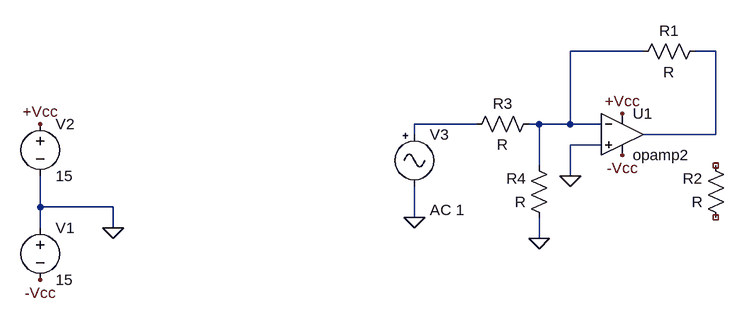
[diagram p0: schematic Draft2.asc]
Draft2.asc, the LTspice schematic file:
Version 4
SHEET 1 880 680
WIRE 240 32 128 32
WIRE 352 32 320 32
WIRE -16 144 -112 144
WIRE 80 144 64 144
WIRE 128 144 128 32
WIRE 128 144 80 144
WIRE 176 144 128 144
WIRE -112 160 -112 144
WIRE 352 160 352 32
WIRE 352 160 240 160
WIRE 176 176 128 176
WIRE 80 208 80 144
WIRE 128 224 128 176
WIRE -688 272 -688 224
WIRE -576 272 -688 272
WIRE -112 288 -112 240
WIRE -688 304 -688 272
WIRE -576 304 -576 272
WIRE 80 320 80 288
FLAG -576 304 0
FLAG -688 144 +Vcc
FLAG 208 128 +Vcc
FLAG -688 384 -Vcc
FLAG 208 192 -Vcc
FLAG 128 224 0
FLAG 80 320 0
FLAG -112 288 0
SYMBOL Opamps\\opamp2 208 96 R0
SYMATTR InstName U1
SYMBOL voltage -688 288 R0
WINDOW 123 0 0 Left 2
WINDOW 39 0 0 Left 2
SYMATTR InstName V1
SYMATTR Value 15
SYMBOL voltage -688 128 R0
WINDOW 123 0 0 Left 2
WINDOW 39 0 0 Left 2
SYMATTR InstName V2
SYMATTR Value 15
SYMBOL res 336 16 R90
WINDOW 0 0 56 VBottom 2
WINDOW 3 32 56 VTop 2
SYMATTR InstName R1
SYMBOL res 368 304 R180
WINDOW 0 36 76 Left 2
WINDOW 3 36 40 Left 2
SYMATTR InstName R2
SYMBOL res 80 128 R90
WINDOW 0 0 56 VBottom 2
WINDOW 3 32 56 VTop 2
SYMATTR InstName R3
SYMBOL res 96 304 R180
WINDOW 0 36 76 Left 2
WINDOW 3 36 40 Left 2
SYMATTR InstName R4
SYMBOL Misc\\signal -112 144 R0
WINDOW 123 24 132 Left 2
WINDOW 39 0 0 Left 2
SYMATTR InstName V3
SYMATTR Value ""
SYMATTR Value2 AC 1

The netlist it stands for:
* Draft2.asc
XU1 0 N001 +Vcc -Vcc N002 opamp2  ; pins In+ In- V+ V- OUT
V1 0 -Vcc 15
V2 +Vcc 0 15
R1 N002 N001 R
R2 NC_01 NC_02 R
R3 N001 N003 R
R4 0 N001 R
V3 N003 0 AC 1
.backanno
.end